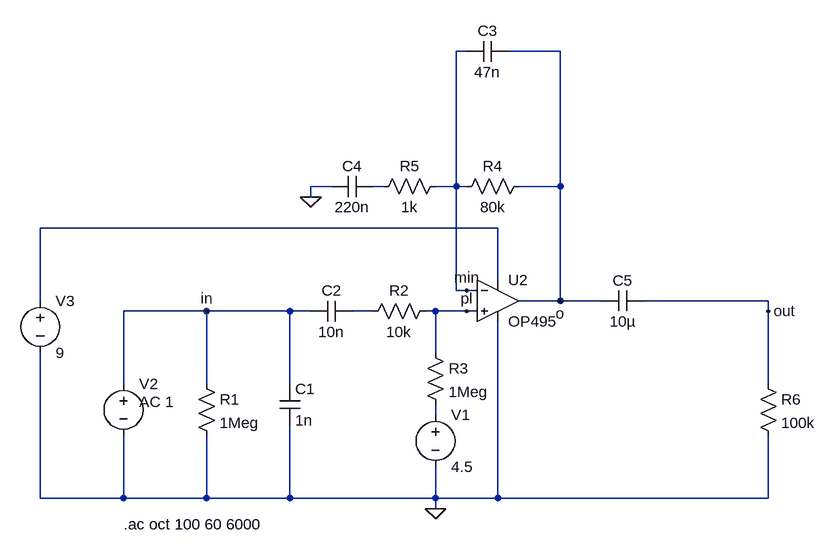
[diagram p0: schematic faden_lowmod.asc]
faden_lowmod.asc, the LTspice schematic file:
Version 4
SHEET 1 880 680
WIRE 208 -528 192 -528
WIRE 352 -528 272 -528
WIRE 0 -320 -32 -320
WIRE 80 -320 64 -320
WIRE 192 -320 192 -528
WIRE 192 -320 160 -320
WIRE 208 -320 192 -320
WIRE 352 -320 352 -528
WIRE 352 -320 288 -320
WIRE -32 -304 -32 -320
WIRE 256 -256 -448 -256
WIRE 256 -176 256 -256
WIRE 192 -160 192 -320
WIRE 208 -160 192 -160
WIRE 224 -160 208 -160
WIRE -448 -144 -448 -256
WIRE 352 -144 352 -320
WIRE 352 -144 288 -144
WIRE 416 -144 352 -144
WIRE 672 -144 480 -144
WIRE -192 -128 -320 -128
WIRE -64 -128 -192 -128
WIRE -32 -128 -64 -128
WIRE 64 -128 32 -128
WIRE 160 -128 144 -128
WIRE 208 -128 160 -128
WIRE 224 -128 208 -128
WIRE 672 -128 672 -144
WIRE 160 -64 160 -128
WIRE -320 -16 -320 -128
WIRE -192 -16 -192 -128
WIRE -64 -16 -64 -128
WIRE 672 -16 672 -128
WIRE 160 32 160 16
WIRE -448 160 -448 -64
WIRE -320 160 -320 64
WIRE -320 160 -448 160
WIRE -192 160 -192 64
WIRE -192 160 -320 160
WIRE -64 160 -64 48
WIRE -64 160 -192 160
WIRE 160 160 160 112
WIRE 160 160 -64 160
WIRE 256 160 256 -112
WIRE 256 160 160 160
WIRE 672 160 672 64
WIRE 672 160 256 160
WIRE 160 176 160 160
FLAG 160 176 0
FLAG -32 -304 0
FLAG 352 -144 o
FLAG -192 -128 in
FLAG 672 -128 out
FLAG 208 -128 pl
FLAG 208 -160 min
SYMBOL res -208 -32 R0
SYMATTR InstName R1
SYMATTR Value 1Meg
SYMBOL cap -80 -16 R0
SYMATTR InstName C1
SYMATTR Value 1n
SYMBOL res 144 -80 R0
SYMATTR InstName R3
SYMATTR Value 1Meg
SYMBOL res 160 -144 R90
WINDOW 0 0 56 VBottom 2
WINDOW 3 32 56 VTop 2
SYMATTR InstName R2
SYMATTR Value 10k
SYMBOL cap 32 -144 R90
WINDOW 0 0 32 VBottom 2
WINDOW 3 32 32 VTop 2
SYMATTR InstName C2
SYMATTR Value 10n
SYMBOL res 304 -336 R90
WINDOW 0 0 56 VBottom 2
WINDOW 3 32 56 VTop 2
SYMATTR InstName R4
SYMATTR Value 80k
SYMBOL res 176 -336 R90
WINDOW 0 0 56 VBottom 2
WINDOW 3 32 56 VTop 2
SYMATTR InstName R5
SYMATTR Value 1k
SYMBOL cap 272 -544 R90
WINDOW 0 0 32 VBottom 2
WINDOW 3 32 32 VTop 2
SYMATTR InstName C3
SYMATTR Value 47n
SYMBOL cap 64 -336 R90
WINDOW 0 0 32 VBottom 2
WINDOW 3 32 32 VTop 2
SYMATTR InstName C4
SYMATTR Value 220n
SYMBOL voltage 160 16 R0
WINDOW 123 0 0 Left 0
WINDOW 39 0 0 Left 0
SYMATTR InstName V1
SYMATTR Value 4.5
SYMBOL voltage -320 -32 R0
WINDOW 3 24 44 Left 2
WINDOW 123 24 44 Left 2
WINDOW 39 0 0 Left 0
SYMATTR Value ""
SYMATTR Value2 AC 1
SYMATTR InstName V2
SYMBOL OpAmps\\OP495 256 -208 R0
SYMATTR InstName U2
SYMBOL voltage -448 -160 R0
WINDOW 123 0 0 Left 0
WINDOW 39 0 0 Left 0
SYMATTR InstName V3
SYMATTR Value 9
SYMBOL cap 480 -160 R90
WINDOW 0 0 32 VBottom 2
WINDOW 3 32 32 VTop 2
SYMATTR InstName C5
SYMATTR Value 10µ
SYMBOL res 656 -32 R0
SYMATTR InstName R6
SYMATTR Value 100k
TEXT -320 200 Left 2 !.ac oct 100 60 6000

The netlist it stands for:
* faden_lowmod.asc
R1 in 0 1Meg
C1 in 0 1n
R3 pl N004 1Meg
R2 pl N003 10k
C2 N003 in 10n
R4 o min 80k
R5 min N001 1k
C3 o min 47n
C4 N001 0 220n
V1 N004 0 4.5
V2 in 0 AC 1
XU2 pl min N002 0 o OP495  ; pins In+ In- V+ V- OUT
V3 N002 0 9
C5 out o 10µ
R6 out 0 100k
.ac oct 100 60 6000
.backanno
.end